# Altium schematic sheet ili9327.SchDoc
size B
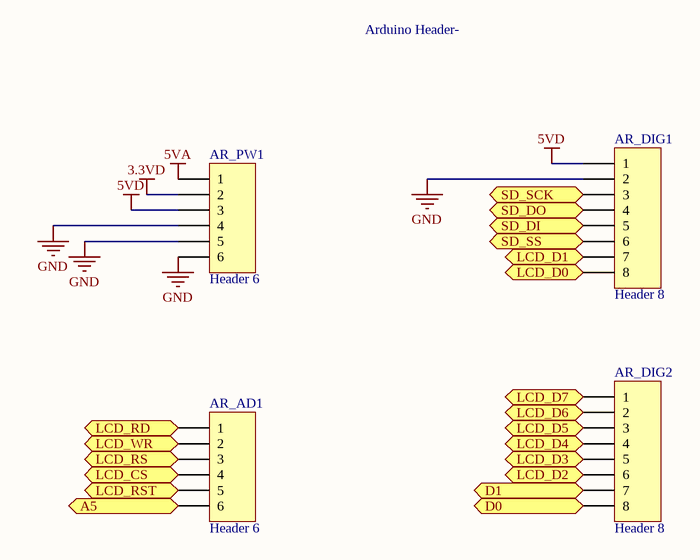
[diagram p0: ili9327.SchDoc]

## Parts
AR_AD1  Header 6  [HDR1X6]
AR_DIG1  Header 8  [HDR1X8]
AR_DIG2  Header 8  [HDR1X8]
AR_PW1  Header 6  [HDR1X6]

## Ports
A5, D0, D1, LCD_CS (in), LCD_D0, LCD_D1, LCD_D2, LCD_D3, LCD_D4, LCD_D5, LCD_D6, LCD_D7, LCD_RD (in), LCD_RS (in), LCD_RST (in), LCD_WR (in), SD_DI (in), SD_DO (in), SD_SCK (in), SD_SS (in)

## Nets
3.3VD: AR_PW1.2
5VA: AR_PW1.1
5VD: AR_DIG1.1 AR_PW1.3
GND: AR_DIG1.2 AR_PW1.4 AR_PW1.5 AR_PW1.6
A5: AR_AD1.6 ; port A5
D0: AR_DIG2.8 ; port D0
D1: AR_DIG2.7 ; port D1
LCD_CS: AR_AD1.4 ; port LCD_CS
LCD_D0: AR_DIG1.8 ; port LCD_D0
LCD_D1: AR_DIG1.7 ; port LCD_D1
LCD_D2: AR_DIG2.6 ; port LCD_D2
LCD_D3: AR_DIG2.5 ; port LCD_D3
LCD_D4: AR_DIG2.4 ; port LCD_D4
LCD_D5: AR_DIG2.3 ; port LCD_D5
LCD_D6: AR_DIG2.2 ; port LCD_D6
LCD_D7: AR_DIG2.1 ; port LCD_D7
LCD_RD: AR_AD1.1 ; port LCD_RD
LCD_RS: AR_AD1.3 ; port LCD_RS
LCD_RST: AR_AD1.5 ; port LCD_RST
LCD_WR: AR_AD1.2 ; port LCD_WR
SD_DI: AR_DIG1.5 ; port SD_DI
SD_DO: AR_DIG1.4 ; port SD_DO
SD_SCK: AR_DIG1.3 ; port SD_SCK
SD_SS: AR_DIG1.6 ; port SD_SS

## Notes on the sheet
- Arduino Header-
- ESE
- is the sole property of ESE. Any reproduction
- The Information Contained in this drawing
- Schematic P/N and Name
- Sheet Name
- 299 Doon Valley Drive
- Kitchener, ON N2G 4M4
- Canada
- Approved
- in part or in whole without the written
- permission of ESE is strictly prohibited.
- APPROVALS
- DATE
- Size
- Scale
- B
- NTS
- Bare PCB P/N
- Date
- Sheet
- Rev.
- Checked
- Engineer
- of

## Library data of the parts
AR_AD1 AR_PW1 = Header 6: Header, 6-Pin; LatestRevisionDate: 17-Jul-2002; LatestRevisionNote: Re-released for DXP Platform.; Publisher: Altium Limited
AR_DIG1 AR_DIG2 = Header 8: Header, 8-Pin; LatestRevisionDate: 17-Jul-2002; LatestRevisionNote: Re-released for DXP Platform.; Publisher: Altium Limited